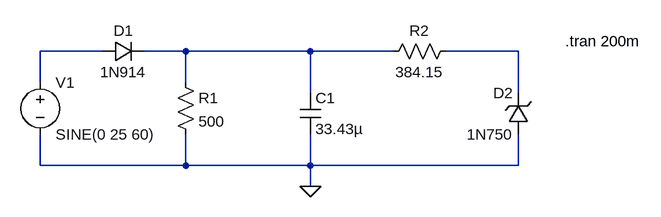
[diagram p0: schematic 4-5-half.asc]
4-5-half.asc, the LTspice schematic file:
Version 4
SHEET 1 908 680
WIRE 48 80 -48 80
WIRE 176 80 112 80
WIRE 368 80 176 80
WIRE 496 80 368 80
WIRE 688 80 576 80
WIRE -48 128 -48 80
WIRE 176 128 176 80
WIRE 368 144 368 80
WIRE 688 144 688 80
WIRE -48 256 -48 208
WIRE 176 256 176 208
WIRE 176 256 -48 256
WIRE 368 256 368 208
WIRE 368 256 176 256
WIRE 688 256 688 208
WIRE 688 256 368 256
WIRE 368 288 368 256
FLAG 368 288 0
SYMBOL diode 48 96 R270
WINDOW 0 32 32 VTop 2
WINDOW 3 0 32 VBottom 2
SYMATTR InstName D1
SYMATTR Value 1N914
SYMBOL res 160 112 R0
SYMATTR InstName R1
SYMATTR Value 500
SYMBOL res 592 64 R90
WINDOW 0 0 56 VBottom 2
WINDOW 3 32 56 VTop 2
SYMATTR InstName R2
SYMATTR Value 384.15
SYMBOL zener 704 208 R180
WINDOW 0 24 64 Left 2
WINDOW 3 24 0 Left 2
SYMATTR InstName D2
SYMATTR Value 1N750
SYMBOL cap 352 144 R0
SYMATTR InstName C1
SYMATTR Value 33.43µ
SYMBOL voltage -48 112 R0
WINDOW 123 0 0 Left 0
WINDOW 39 0 0 Left 0
SYMATTR InstName V1
SYMATTR Value SINE(0 25 60)
TEXT 760 64 Left 2 !.tran 200m

The netlist it stands for:
* 4-5-half.asc
D1 N001 N002 1N914
R1 N002 0 500
R2 N003 N002 384.15
D2 0 N003 1N750
C1 N002 0 33.43µ
V1 N001 0 SINE(0 25 60)
.model D D
.lib standard.dio
.tran 200m
.backanno
.end